# Altium schematic sheet PWR_MGMT.SchDoc
size C; SheetNumber: 15; SheetTotal: 19
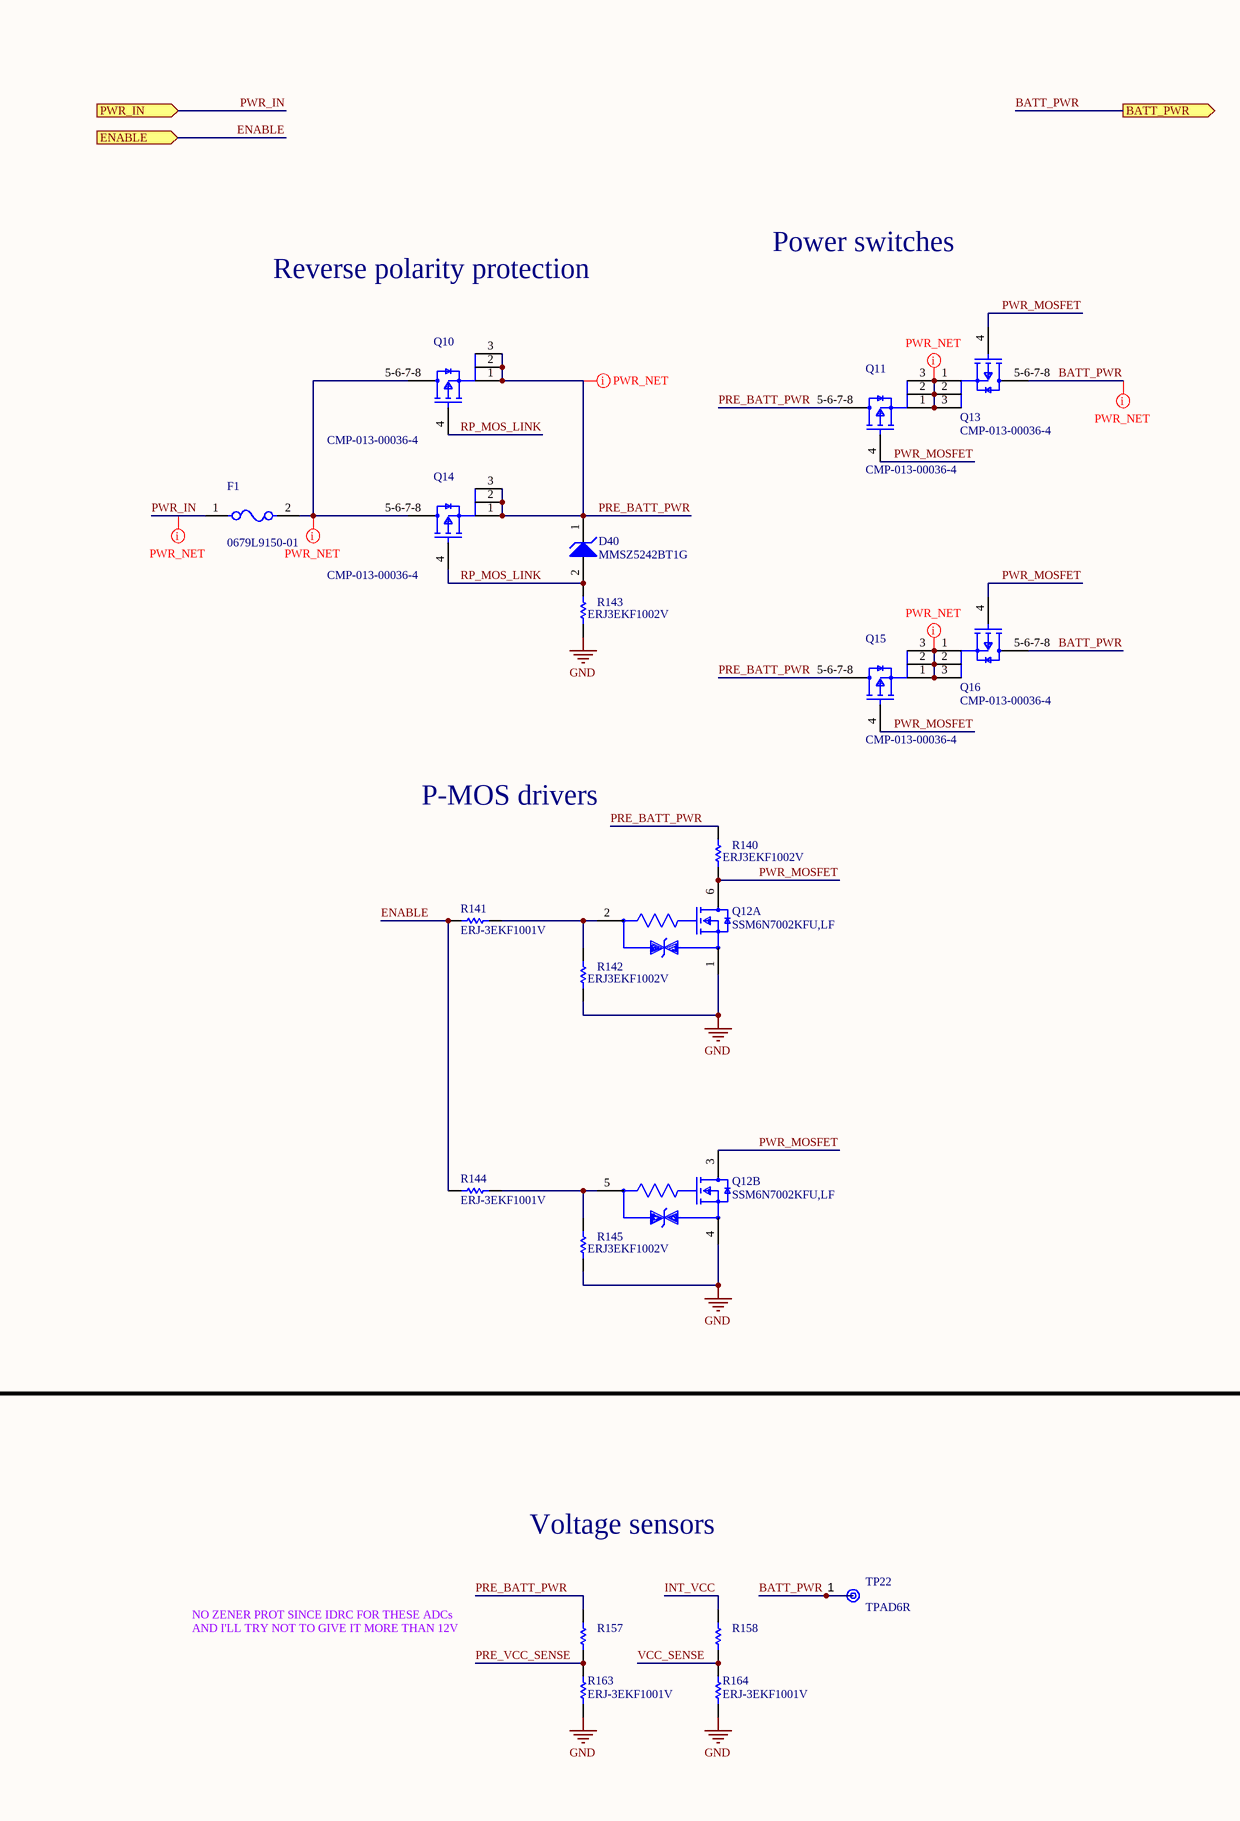
[diagram p0: PWR_MGMT.SchDoc, left]
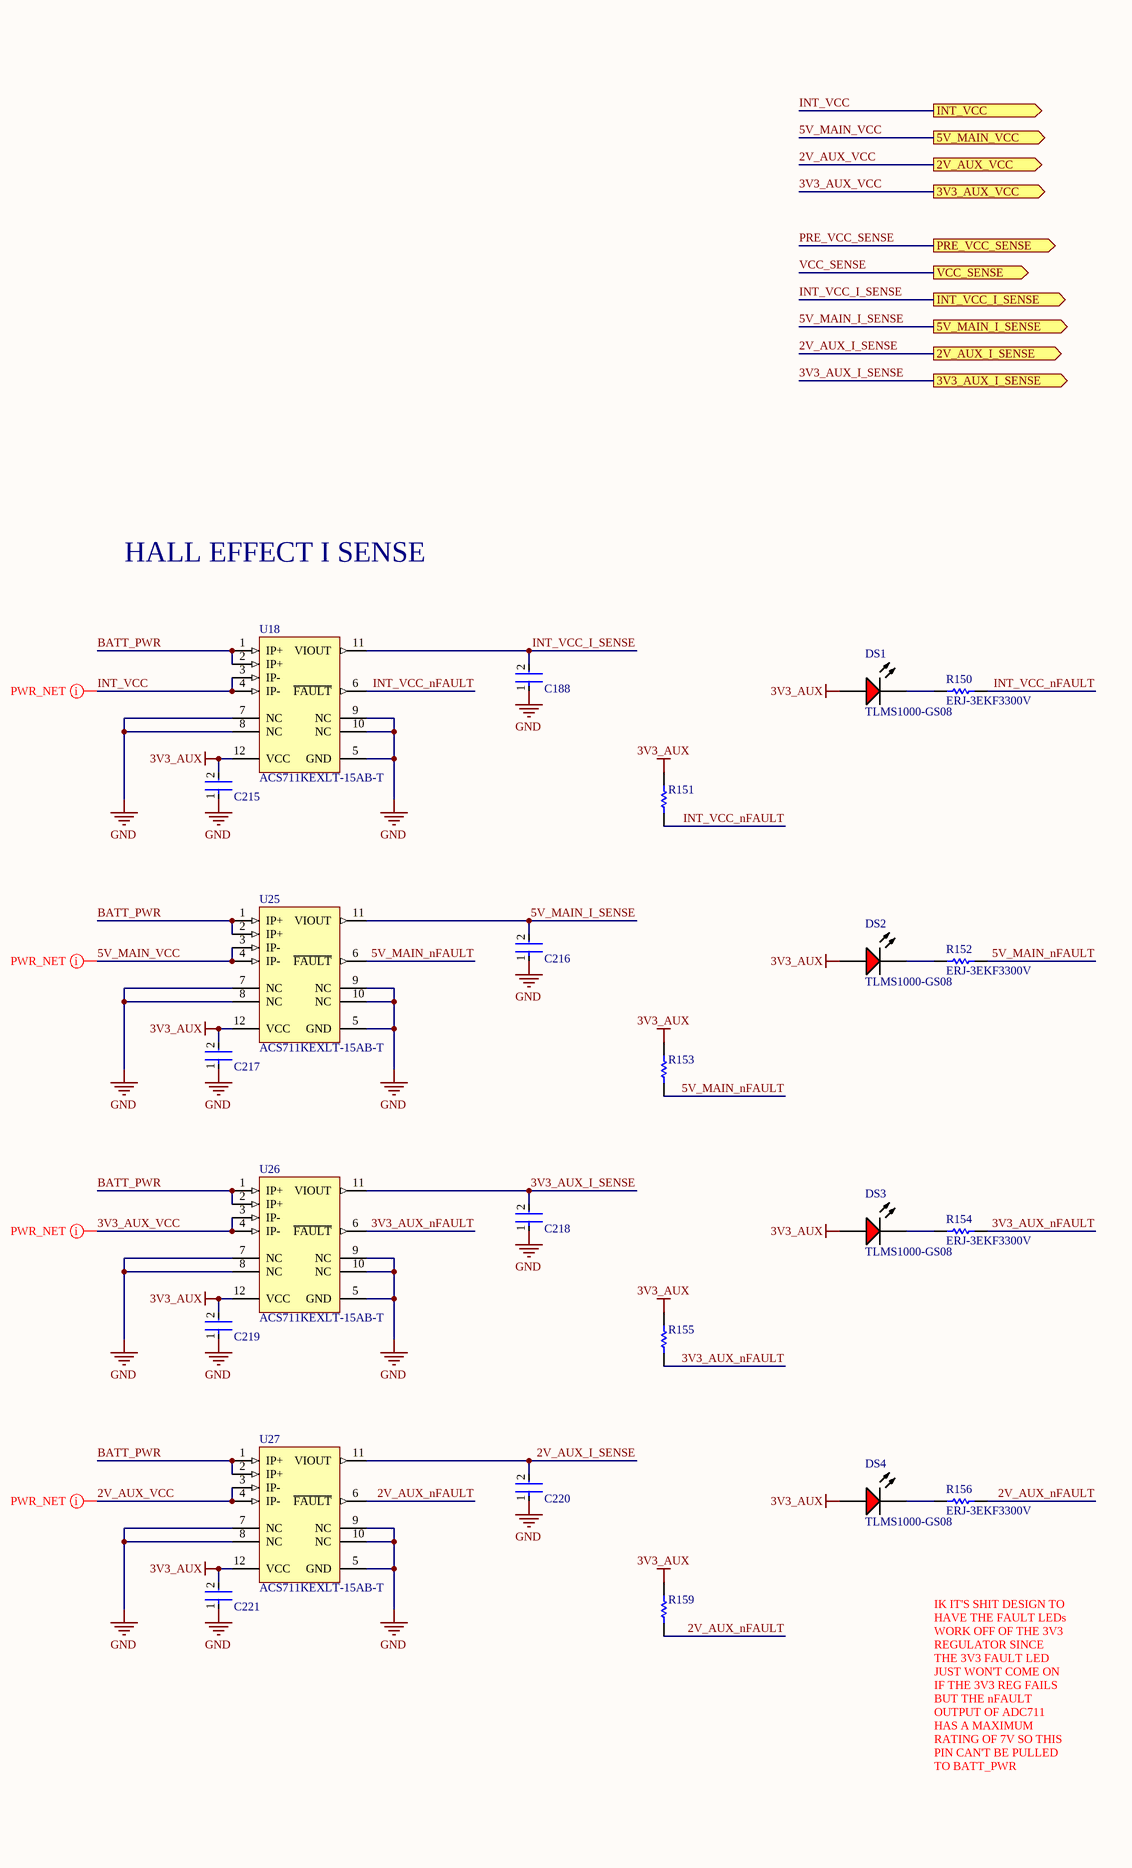
[diagram p1: PWR_MGMT.SchDoc, right]

## Parts
C188  C0402C104K8PACTU  [FP-C0402-BB-MFG]  (value not drawn)
C215  C0402C104K8PACTU  [FP-C0402-BB-MFG]  (value not drawn)
C216  C0402C104K8PACTU  [FP-C0402-BB-MFG]  (value not drawn)
C217  C0402C104K8PACTU  [FP-C0402-BB-MFG]  (value not drawn)
C218  C0402C104K8PACTU  [FP-C0402-BB-MFG]  (value not drawn)
C219  C0402C104K8PACTU  [FP-C0402-BB-MFG]  (value not drawn)
C220  C0402C104K8PACTU  [FP-C0402-BB-MFG]  (value not drawn)
C221  C0402C104K8PACTU  [FP-C0402-BB-MFG]  (value not drawn)
D40  MMSZ5242BT1G  [ONSC-SOD-123-2-425-04_V]
DS1  TLMS1000-GS08  [VISH-TLMS1000_V]
DS2  TLMS1000-GS08  [VISH-TLMS1000_V]
DS3  TLMS1000-GS08  [VISH-TLMS1000_V]
DS4  TLMS1000-GS08  [VISH-TLMS1000_V]
F1  0679L9150-01  [FP-0679L-MFG]
Q10  CMP-013-00036-4  [SISH615ADN-T1-GE3-Footprint-1]
Q11  CMP-013-00036-4  [SISH615ADN-T1-GE3-Footprint-1]
Q12  SSM6N7002KFU,LF  [FP-SSOP6-P-0_65A-MFG]  (parts A,B of 2)
Q13  CMP-013-00036-4  [SISH615ADN-T1-GE3-Footprint-1]
Q14  CMP-013-00036-4  [SISH615ADN-T1-GE3-Footprint-1]
Q15  CMP-013-00036-4  [SISH615ADN-T1-GE3-Footprint-1]
Q16  CMP-013-00036-4  [SISH615ADN-T1-GE3-Footprint-1]
R140  ERJ3EKF1002V  [RESC1609X55X30LL15T15]
R141  ERJ-3EKF1001V  [RESC1608X55X30LL15T15]
R142  ERJ3EKF1002V  [RESC1609X55X30LL15T15]
R143  ERJ3EKF1002V  [RESC1609X55X30LL15T15]
R144  ERJ-3EKF1001V  [RESC1608X55X30LL15T15]
R145  ERJ3EKF1002V  [RESC1609X55X30LL15T15]
R150  ERJ-3EKF3300V  [RESC1608X55X30LL15T15]
R151  ERJ3EKF1002V  [RESC1609X55X30LL15T15]  (value not drawn)
R152  ERJ-3EKF3300V  [RESC1608X55X30LL15T15]
R153  ERJ3EKF1002V  [RESC1609X55X30LL15T15]  (value not drawn)
R154  ERJ-3EKF3300V  [RESC1608X55X30LL15T15]
R155  ERJ3EKF1002V  [RESC1609X55X30LL15T15]  (value not drawn)
R156  ERJ-3EKF3300V  [RESC1608X55X30LL15T15]
R157  ERJ3EKF1002V  [RESC1609X55X30LL15T15]  (value not drawn)
R158  ERJ3EKF1002V  [RESC1609X55X30LL15T15]  (value not drawn)
R159  ERJ3EKF1002V  [RESC1609X55X30LL15T15]  (value not drawn)
R163  ERJ-3EKF1001V  [RESC1608X55X30LL15T15]
R164  ERJ-3EKF1001V  [RESC1608X55X30LL15T15]
TP22  TPAD6R  [New footprint 1]
U18  ACS711KEXLT-15AB-T  [ALEG-EX-12_V]
U25  ACS711KEXLT-15AB-T  [ALEG-EX-12_V]
U26  ACS711KEXLT-15AB-T  [ALEG-EX-12_V]
U27  ACS711KEXLT-15AB-T  [ALEG-EX-12_V]

## Ports
2V_AUX_I_SENSE (out, see VISION_BETA_EBB[3B], ADC[1B]), 2V_AUX_VCC (out, see VISION_BETA_EBB[3B]), 3V3_AUX_I_SENSE (out, see VISION_BETA_EBB[3B], ADC[1B]), 3V3_AUX_VCC (out, see VISION_BETA_EBB[3B]), 5V_MAIN_I_SENSE (out, see VISION_BETA_EBB[3B], ADC[1B]), 5V_MAIN_VCC (out, see VISION_BETA_EBB[3A]), BATT_PWR (out), ENABLE (in, see VISION_BETA_EBB[3B]), INT_VCC (out, see VISION_BETA_EBB[3A]), INT_VCC_I_SENSE (out, see VISION_BETA_EBB[3B], ADC[1B]), PRE_VCC_SENSE (out, see VISION_BETA_EBB[3B], ADC[1A]), PWR_IN (in, see VISION_BETA_EBB[2A]), VCC_SENSE (out, see VISION_BETA_EBB[3B], ADC[1A])

## Nets
3V3_AUX: C215.2 C217.2 C219.2 C221.2 DS1.1(A) DS2.1(A) DS3.1(A) DS4.1(A) R151.2 R153.2 R155.2 R159.2 U18.12(VCC) U25.12(VCC) U26.12(VCC) U27.12(VCC)
GND: C188.1 C215.1 C216.1 C217.1 C218.1 C219.1 C220.1 C221.1 Q12.1(Source1) Q12.4(Source2) R142.2 R143.2 R145.2 R163.1 R164.1 U18.5(GND) U18.7(NC) U18.8(NC) U18.9(NC) U18.10(NC) U25.5(GND) U25.7(NC) U25.8(NC) U25.9(NC) U25.10(NC) U26.5(GND) U26.7(NC) U26.8(NC) U26.9(NC) U26.10(NC) U27.5(GND) U27.7(NC) U27.8(NC) U27.9(NC) U27.10(NC)
2V_AUX_I_SENSE: C220.2 U27.11(VIOUT) ; port 2V_AUX_I_SENSE
2V_AUX_nFAULT: R156.2 R159.1 U27.6(~{FAULT})
2V_AUX_VCC: U27.3(IP-) U27.4(IP-) ; port 2V_AUX_VCC
3V3_AUX_I_SENSE: C218.2 U26.11(VIOUT) ; port 3V3_AUX_I_SENSE
3V3_AUX_nFAULT: R154.2 R155.1 U26.6(~{FAULT})
3V3_AUX_VCC: U26.3(IP-) U26.4(IP-) ; port 3V3_AUX_VCC
5V_MAIN_I_SENSE: C216.2 U25.11(VIOUT) ; port 5V_MAIN_I_SENSE
5V_MAIN_nFAULT: R152.2 R153.1 U25.6(~{FAULT})
5V_MAIN_VCC: U25.3(IP-) U25.4(IP-) ; port 5V_MAIN_VCC
BATT_PWR: Q13.5-6-7-8(D) Q16.5-6-7-8(D) TP22.1(TP) U18.1(IP+) U18.2(IP+) U25.1(IP+) U25.2(IP+) U26.1(IP+) U26.2(IP+) U27.1(IP+) U27.2(IP+) ; port BATT_PWR
ENABLE: R141.1 R144.1 ; port ENABLE
INT_VCC: R158.1 U18.3(IP-) U18.4(IP-) ; port INT_VCC
INT_VCC_I_SENSE: C188.2 U18.11(VIOUT) ; port INT_VCC_I_SENSE
INT_VCC_nFAULT: R150.2 R151.1 U18.6(~{FAULT})
PRE_BATT_PWR: D40.1(K) Q10.1(S) Q10.2(S) Q10.3(S) Q11.5-6-7-8(D) Q14.1(S) Q14.2(S) Q14.3(S) Q15.5-6-7-8(D) R140.1 R157.1
PRE_VCC_SENSE: R157.2 R163.2 ; port PRE_VCC_SENSE
PWR_IN: F1.1 ; port PWR_IN
PWR_MOSFET: Q11.4(G) Q12.3(Drain2) Q12.6(Drain1) Q13.4(G) Q15.4(G) Q16.4(G) R140.2
RP_MOS_LINK: D40.2(A) Q10.4(G) Q14.4(G) R143.1
VCC_SENSE: R158.2 R164.2 ; port VCC_SENSE
NetDS1_2: DS1.2(K) R150.1
NetDS2_2: DS2.2(K) R152.1
NetDS3_2: DS3.2(K) R154.1
NetDS4_2: DS4.2(K) R156.1
NetF1_2: F1.2 Q10.5-6-7-8(D) Q14.5-6-7-8(D)
NetQ11_1: Q11.1(S) Q11.2(S) Q11.3(S) Q13.1(S) Q13.2(S) Q13.3(S)
NetQ12_2: Q12.2(Gate1) R141.2 R142.1
NetQ12_5: Q12.5(Gate2) R144.2 R145.1
NetQ15_1: Q15.1(S) Q15.2(S) Q15.3(S) Q16.1(S) Q16.2(S) Q16.3(S)

## Layout directives
net class PWR: 2V_AUX_VCC, 3V3_AUX_VCC, 5V_MAIN_VCC, BATT_PWR, INT_VCC, NetF1_2, NetQ11_1, NetQ15_1, PRE_BATT_PWR, PWR_IN

## Notes on the sheet
- Power switches
- Reverse polarity protection
- HALL EFFECT I SENSE
- P-MOS drivers
- Voltage sensors
- NO ZENER PROT SINCE IDRC FOR THESE ADCs
- AND I'LL TRY NOT TO GIVE IT MORE THAN 12V
- IK IT'S SHIT DESIGN TO HAVE THE FAULT LEDs WORK OFF OF THE 3V3 REGULATOR SINCE THE 3V3 FAULT LED JUST WON'T COME ON IF THE 3V3 REG FAILS BUT THE nFAULT OUTPUT OF ADC711 HAS A MAXIMUM RATING OF 7V SO THIS PIN CAN'T BE PULLED TO BATT_PWR

## Library data of the parts
C188 C215-C221 = CMP-2008-02046-2: CAP CER 0.1UF 10V X5R 0402; Manufacturer: Kemet; Material: Ceramic; Capacitance: 0.10 μF; Temperature Coefficient: 15%; Tolerance: 0.1; Value: 0.10 μF; Package: C0402-BB; Temperature: -55°C to +125°C; ComponentLink2Description: Datasheet; Temperature Characteristic: X5R; Device Class L1: Passive Components; Height: 0.55mm; Lead Free: Yes; ComponentLink2URL: https://content.kemet.com/datasheets/KEM_C1002_X7R_SMD.pdf; Device Class L2: Capacitors; Temperature Range Low: -55°C; Temperature Range High: +125°C; RoHS: TRUE; Octopart: https://octopart.com/c0402c104k8pactu-kemet-140039; Automotive: No; Mouser Description: Capacitor 100 nF 10 VDC 0402; Category: Cap; Voltage Rating: 10 V; Digikey Description: CAP CER 0.1UF 10V X5R 0402; Ipc Land Pattern Name: CAPC10050X50; Device Class L3: Ceramic Capacitors; Manufacturer Part Number: C0402C104K8PACTU
D40 = CMP-1060-00565-1: Zener Voltage Regulator, 500 mW, 2-Pin SOD-123, Pb-Free, Tape and Reel; Manufacturer: On Semiconductor; P Max (W): 0.5; VZ Typ (V): 12; PartNumber: MMSZ5242BT1G; PackageReference: SOD-123-2-425-04; ComponentLink3URL: http://www.onsemi.com/pub_link/Collateral/425-04.PDF; Mounting Technology: Surface Mount; ComponentLink2Description: Datasheet; ComponentLink1URL: http://www.onsemi.com/; ComponentLink3Description: Package Specification; PackageDescription: 2-Pin SOD, Body 1.6 x 2.69 mm; PackageVersion: Rev. G, 10/2009; ComponentLink1Description: Manufacturer URL; RoHS: Pb-Free; ComponentLink2URL: http://www.onsemi.com/pub_link/Collateral/MMSZ5221BT1-D.PDF; Packing: Tape and Reel; DatasheetVersion: Rev. 12
DS1-DS4 = CMP-2000-07254-1: Low Current LED, 40 mW, 1.8 V, -40 to 100 degC, 2-Pin SMD (0603), RoHS, Tape and Reel; Manufacturer: Vishay; Lens Shape: Rectangular; Automotive Qualification Standard: AEC-Q100; Wavelength Typ: 636nm; SVHC: ToBeAdvised; LED Colour: Red; Bulb Size: 1.6mmx0.8mm; Forward Voltage: 1.8V; Luminous Intensity: 4mcd; Forward Current If: 2mA; Viewing Angle: 80°; Datasheet Version: Rev. 1.7, 02/2011; Datasheet URL: https://datasheet.ciiva.com/5798/1698881-5798337.pdf; LED Mounting: SMD; Packaging: CutTape; Package Reference: TLMS1000; Manufacturer URL: http://www.vishay.com/; Mounting Technology: SurfaceMount; Product Range: -; Package Description: 2-Pin Surface Mount Device, Body 1.6 x 0.8 mm; MSL: MSL2-1year
F1 = CMP-16042-000002-1: FUSE BRD MNT 15A 125VAC/VDC; Manufacturer: Bel Fuse; Max Fuse Ac Voltage: 125V; Fuse Blow Speed: Fast; Fuse I2T: 103.5A2Sec; Fuse Interrupt Ac Current: 50A; Automotive Grade: Grade 1; Value: 0.0038Ω; Fuse Interrupt Dc Current: 300A; Fuse Voltage Drop: 0.13V; Device Class L2: Fuses; ComponentLink2URL: https://www.belfuse.com/resources/CircuitProtection/datasheets/0679L%20Sep2016.pdf; Package: 0679L; Height: 2.79mm; Digikey Description: FUSE BRD MNT 15A 125VAC/VDC; Temperature Range High: +125°C; Device Class L3: unset; Octopart: https://octopart.com/0679l9150-01-bel+fuse-70850665; Temperature Range Low: -55°C; Fuse Current: 15A; Max Fuse Dc Voltage: 125V; Ipc Land Pattern Name: CAPC610254X254; Manufacturer Part Number: 0679L9150-01; Category: Fuse; Lead Free: Yes; Automotive: Yes; Resistance: 0.0038Ω; RoHS: TRUE; Device Class L1: Circuit Protection; ComponentLink2Description: Datasheet; Temperature: -55°C to +125°C; Voltage Rating: 125V
Q10 Q11 Q13-Q16 = CMP-013-00018-2: Trans MOSFET P-CH 20V 22.1A 8-Pin PowerPAK 1212 EP T/R; Component Type: Standard; Design Item ID: CMP-013-00036-4; Pins: 5; Source: SISH615ADN-T1-GE3.SchLib
Q12 = CMP-35916-000009-1: MOSFET 2N-CH 60V 0.3A; Input Capacitance: 40pF; Continuous Drain Current (ID): 300mA; Max Power Dissipation: 285mW; FET Type: 2 N-Channel; Rds On Max: 1.5R; Mount: Surface Mount; Drain to Source Voltage (Vdss): 60V; Packaging: Tape and Reel
R140 R142 R143 R145 R151 R153 R155 R157-R159 = CMP-1012-00623-3: Chip Resistor, 10 KOhm, +/- 1%, 0.1 W, -55 to 155 degC, 0603 (1608 Metric), RoHS, Tape and Reel; Manufacturer: Panasonic; Voltage Rating: 75V; Case\/Package: 0603; Power Rating: 100mW; Resistance: 10KOhm; Temperature Coefficient: 100ppm\/degreesC; Number of Pins: 2; Package Reference: 603; Depth: 0.8mm; Mount: SurfaceMount; Package Description: 2-Pin Surface Mount Device, Body 1.6 x 0.85 mm; Datasheet Version: 02/2017; Length: 1.6mm; Lead Free: LeadFree; Height: 0.45mm; Number of Terminations: 2; Max Power Dissipation: 100mW; Min Operating Temperature: -55degC; Datasheet URL: https://industrial.panasonic.com/cdbs/www-data/pdf/RDA0000/AOA0000C304.pdf; Termination: SMD/SMT; Case Code (Metric): 1608; Case Code (Imperial): 0603; Tolerance: 1%; Max Operating Temperature: 155degC; RoHSCompliant: true; Voltage Rating (DC): 75V; Radiation Hardening: No; Packaging: TapeandReel; Composition: ThickFilm; Mounting Technology: SurfaceMount; Manufacturer URL: http://www.panasonic.com/; Width: 0.031inch; REACH SVHC: NoSVHC; Contact Plating: Tin; Military Standard: Not; Package Quantity: 1
R141 R144 R163 R164 = CMP-2000-00180-1: Manufacturer: Panasonic; Part Number: ERJ-3EKF1001V
R150 R152 R154 R156 = CMP-2000-00435-2: Chip Resistor, 330 Ohm, +/- 1%, 0.1 W, -55 to 155 degC, 0603 (1608 Metric), RoHS, Tape and Reel; Gender: Male; Mating Cycles: 10000; Current Rating: 500 mA; Voltage Rating: 10 V; REACH SVHC: No SVHC; PackageDescription: 2-Pin Surface Mount Device, Body 1.6 x 0.85 mm; Contact Finish: Gold; Pins: 8; ComponentLink1Description: Manufacturer URL; Packaging: Tape and Reel; Max Operating Temperature: 85 degC; Contact Material: Copper; Height: 1.45 mm; Width: 1.45 mm; DatasheetVersion: Apr-15; Package Quantity: 1500; Contact Plating: Gold; PackageReference: 0603; Mount: Surface Mount; Lead Pitch: 1.1 mm; Min Operating Temperature: -25 degC; ComponentLink1URL: http://www.panasonic.com/; ComponentLink2URL: http://industrial.panasonic.com/cdbs/www-data/pdf/RDA0000/AOA0000C86.pdf; Length: 13.7 mm; ComponentLink2Description: Datasheet; RoHSCompliant: true
TP22 = CMP-00025-2: Test Point .6mm
U18 U25-U27 = CMP-1557-00001-1: Hall Effect Linear Current Sensor with Overcurrent Fault Output for <100 V Isolation Applications, 3 to 5.5 V, -15.5 to 15.5 A IP, -40 to 125 degC, 12-Pin QFN (EX), RoHS, Tape and Reel; VCC Max: 5.5 V; IP Max: 15.5 A; VCC Min: 3 V; IP Min: -15.5 A; -3dB Bandwidth: 0.1 MHz; PackageDescription: 12-Pin Quad Flat No-Lead, Body 3 x 3 mm, Height 0.8 mm; ComponentLink1URL: http://www.allegromicro.com/; Packing: Tape and Reel; ComponentLink2URL: http://www.allegromicro.com/~/media/Files/Datasheets/ACS711-Datasheet.ashx?la=en; DatasheetVersion: Rev. 3; PartNumber: ACS711KEXLT-15AB-T; ComponentLink2Description: Datasheet; ComponentLink3URL: http://www.allegromicro.com/~/media/Files/Datasheets/ACS711-Datasheet.ashx?la=en; RoHS: TRUE; ComponentLink1Description: Manufacturer URL; ComponentLink3Description: Package Specification; Temperature Max: 125 degC; Mounting Technology: Surface Mount; Temperature Min: -40 degC